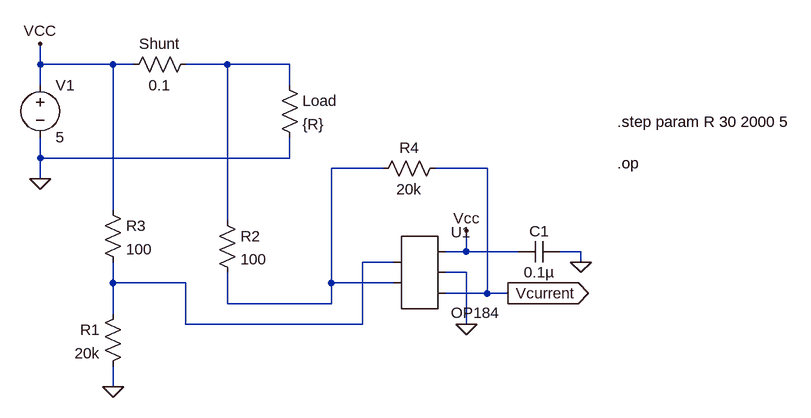
[diagram p0: schematic chargeVariable.asc]
* chargeVariable.asc
R§Shunt N001 Vcc 0.1
V1 Vcc 0 5
R§Load N001 0 {R}
C1 0 Vcc 0.1µ
R1 N003 0 20k
R2 N001 N002 100
R3 Vcc N003 100
R4 Vcurrent N002 20k
* U1: OP184 (symbol AutoGenerated\OP184 not available, pins judged from their places): pin1=N003 pin2=N002 pin3=Vcc pin4=0 pin5=Vcurrent
.op
.step param R 30 2000 5
.backanno
.end

* Results of the author's LTspice run, read from the files saved beside the schematic
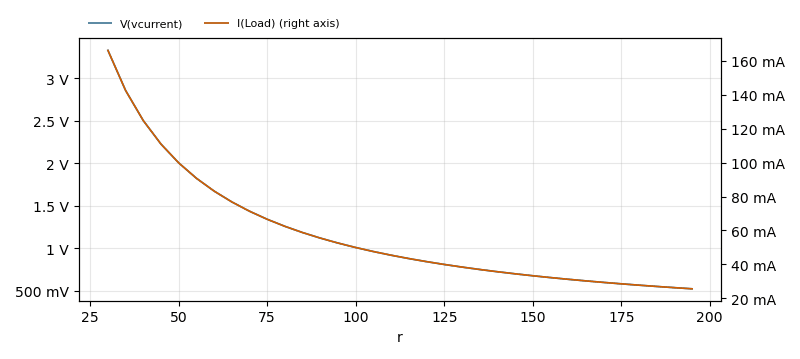
[diagram p1: Operating Point of chargeVariable.asc, plotted from the saved traces]
* Operating Point, 1 run:
*   V(vcurrent): 3.33 V at r=30 , 523.3 mV at r=195 , min 523.3 mV, max 3.33 V
*   I(Load): 166.1 mA at r=30 , 25.63 mA at r=195 , min 25.63 mA, max 166.1 mA